# EAGLE design yuniminMotorBoardAnalog (EAGLE 4.11)
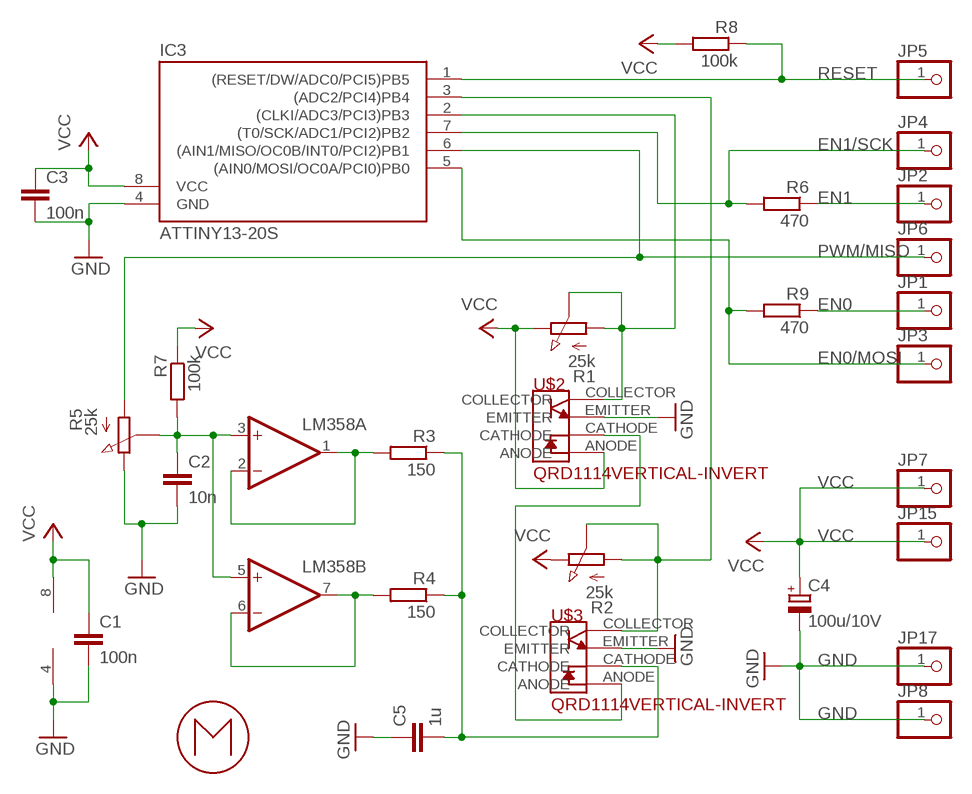
[diagram p0: schematic, sheet 1]

## Parts
C1  100n  C-EUC1206  [C1206]
C2  10n  C-EUC1206  [C1206]
C3  100n  C-EUC1206  [C1206]
C4  100u/10V  CPOL-EUC/6032-28R  [C/6032-28R]
C5  1u  C-EUC1206  [C1206]
IC3  ATTINY13-20S  [SOIC8]
JP1  PINHD-1X1  [1X01]
JP2  PINHD-1X1  [1X01]
JP3  PINHD-1X1  [1X01]
JP4  PINHD-1X1  [1X01]
JP5  PINHD-1X1  [1X01]
JP6  PINHD-1X1  [1X01]
JP7  PINHD-1X1  [1X01]
JP8  PINHD-1X1  [1X01]
JP15  PINHD-1X1  [1X01]
JP17  PINHD-1X1  [1X01]
LM358  TL062D  [SO08]
R1  25k  PC25  [PC25]
R2  25k  PC25  [PC25]
R3  150  R-EU_R1206  [R1206]
R4  150  R-EU_R1206  [R1206]
R5  25k  PC25  [PC25]
R6  470  R-EU_R1206  [R1206]
R7  100k  R-EU_R1206  [R1206]
R8  100k  R-EU_R1206  [R1206]
R9  470  R-EU_R1206  [R1206]
U$1  MOTORGW8FRONT  [GW8L_FRONT]
U$2  QRD1114VERTICAL-INVERT  [QRD1114V-INVERT]
U$3  QRD1114VERTICAL-INVERT  [QRD1114V-INVERT]

## Nets
EN0: JP1.1 R9.1
EN0/MOSI: IC3.5((AIN0/MOSI/OC0A/PCI0)PB0) JP3.1 R9.2
EN1: JP2.1 R6.1
EN1/SCK: IC3.7((T0/SCK/ADC1/PCI2)PB2) JP4.1 R6.2
GND: C1.2 C2.2 C3.2 C4.- C5.1 IC3.4(GND) JP8.1 JP17.1 LM358.4(P:V-) R5.E U$2.EMITTER U$3.EMITTER
N$1: LM358.1(A:OUT) LM358.2(A:-IN) R3.2
N$2: IC3.2((CLKI/ADC3/PCI3)PB3) R1.A R1.S U$2.COLLECTOR
N$3: LM358.6(B:-IN) LM358.7(B:OUT) R4.2
N$4: U$2.CATHODE U$3.ANODE
N$6: IC3.3((ADC2/PCI4)PB4) R2.A R2.S U$3.COLLECTOR
N$8: C2.1 LM358.3(A:+IN) LM358.5(B:+IN) R5.S R7.2
N$9: C5.2 R3.1 R4.1 U$3.CATHODE
PWM/MISO: IC3.6((AIN1/MISO/OC0B/INT0/PCI2)PB1) JP6.1 R5.A
RESET: IC3.1((RESET/DW/ADC0/PCI5)PB5) JP5.1 R8.1
VCC: C1.1 C3.1 C4.+ IC3.8(VCC) JP7.1 JP15.1 LM358.8(P:V+) R1.E R2.E R7.1 R8.2 U$2.ANODE

## Library data of the parts
C1-C3 C5 = rcl:C-EU: CAPACITOR, European symbol
C4 = rcl:CPOL-EU: POLARIZED CAPACITOR, European symbol
IC3 = avr:ATTINY13: MICROCONTROLLER 1 Kbytes FLASH 64 bytes EEPROM 64 bytes RAM 4-channel 10 bit ADC
JP1-JP8 JP15 JP17 = pinhead:PINHD-1X1: PIN HEADER
LM358 = linear:TL062: OP AMP
R1 R2 R5 = potSmdMax:PC25: VITROHM POTENTIOMETER
R3 R4 R6-R9 = rcl:R-EU_: RESISTOR, European symbol
U$1 = motors:MOTORGW8
U$2 U$3 = sensor:QRD1114

## Board
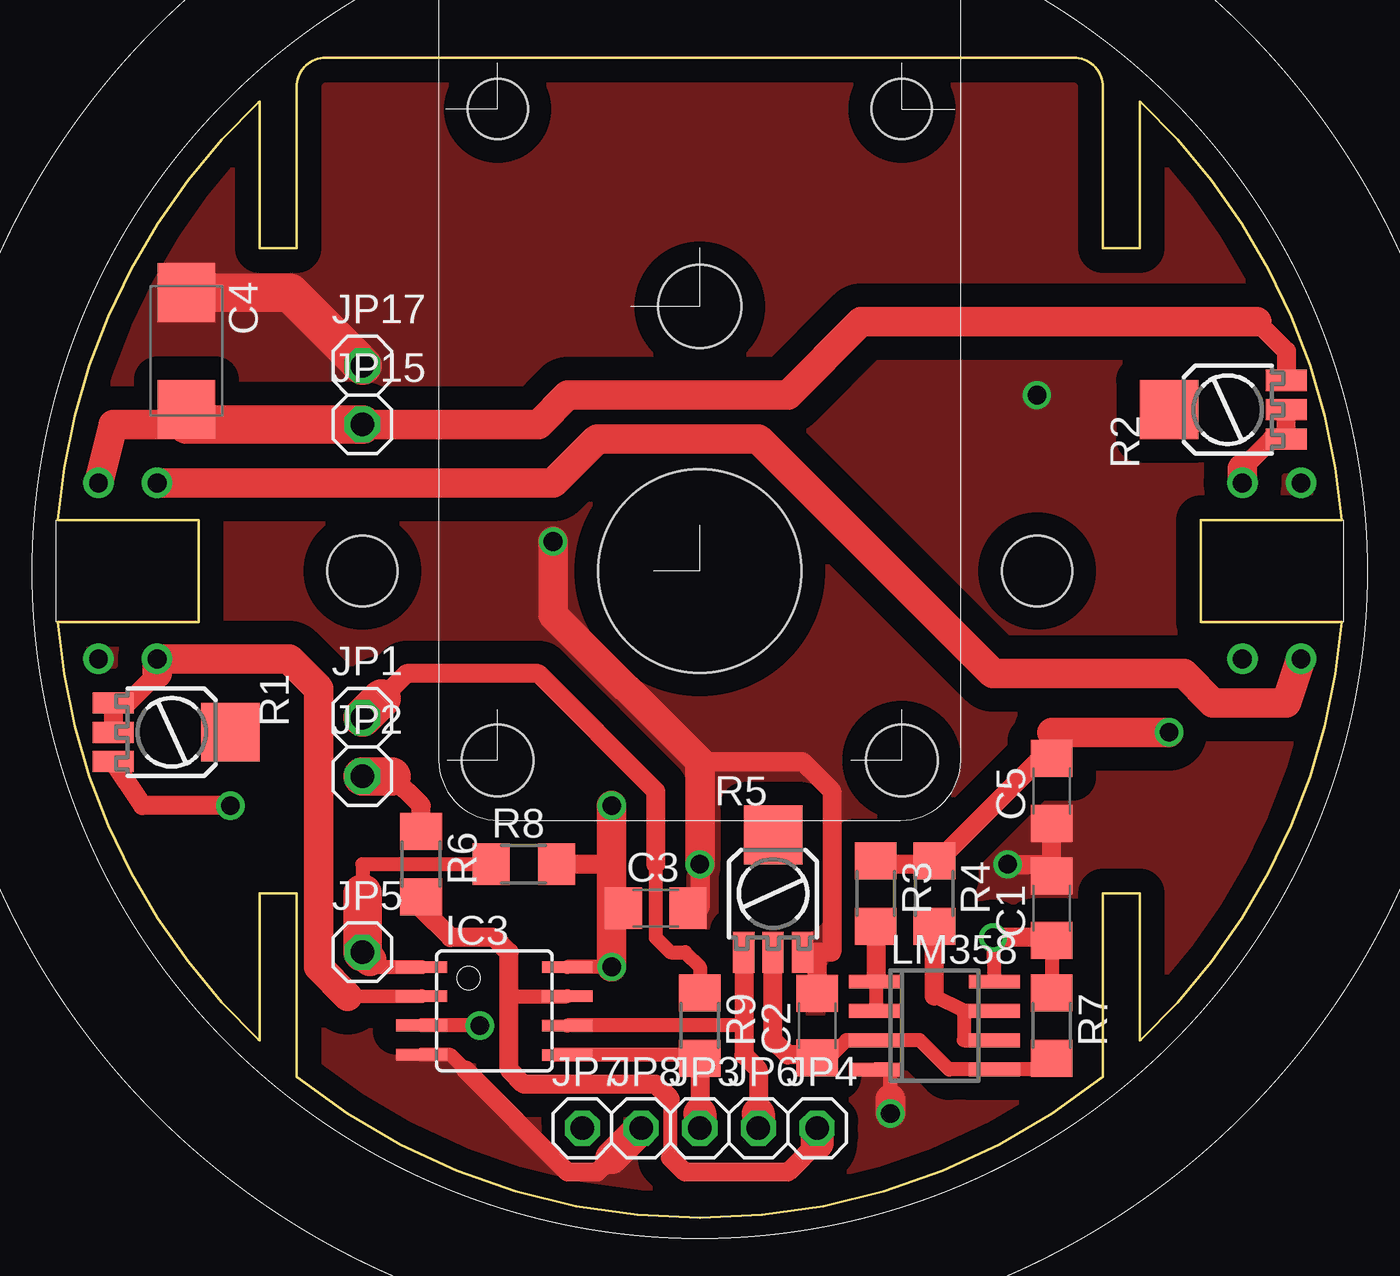
[diagram p1: board, top side]
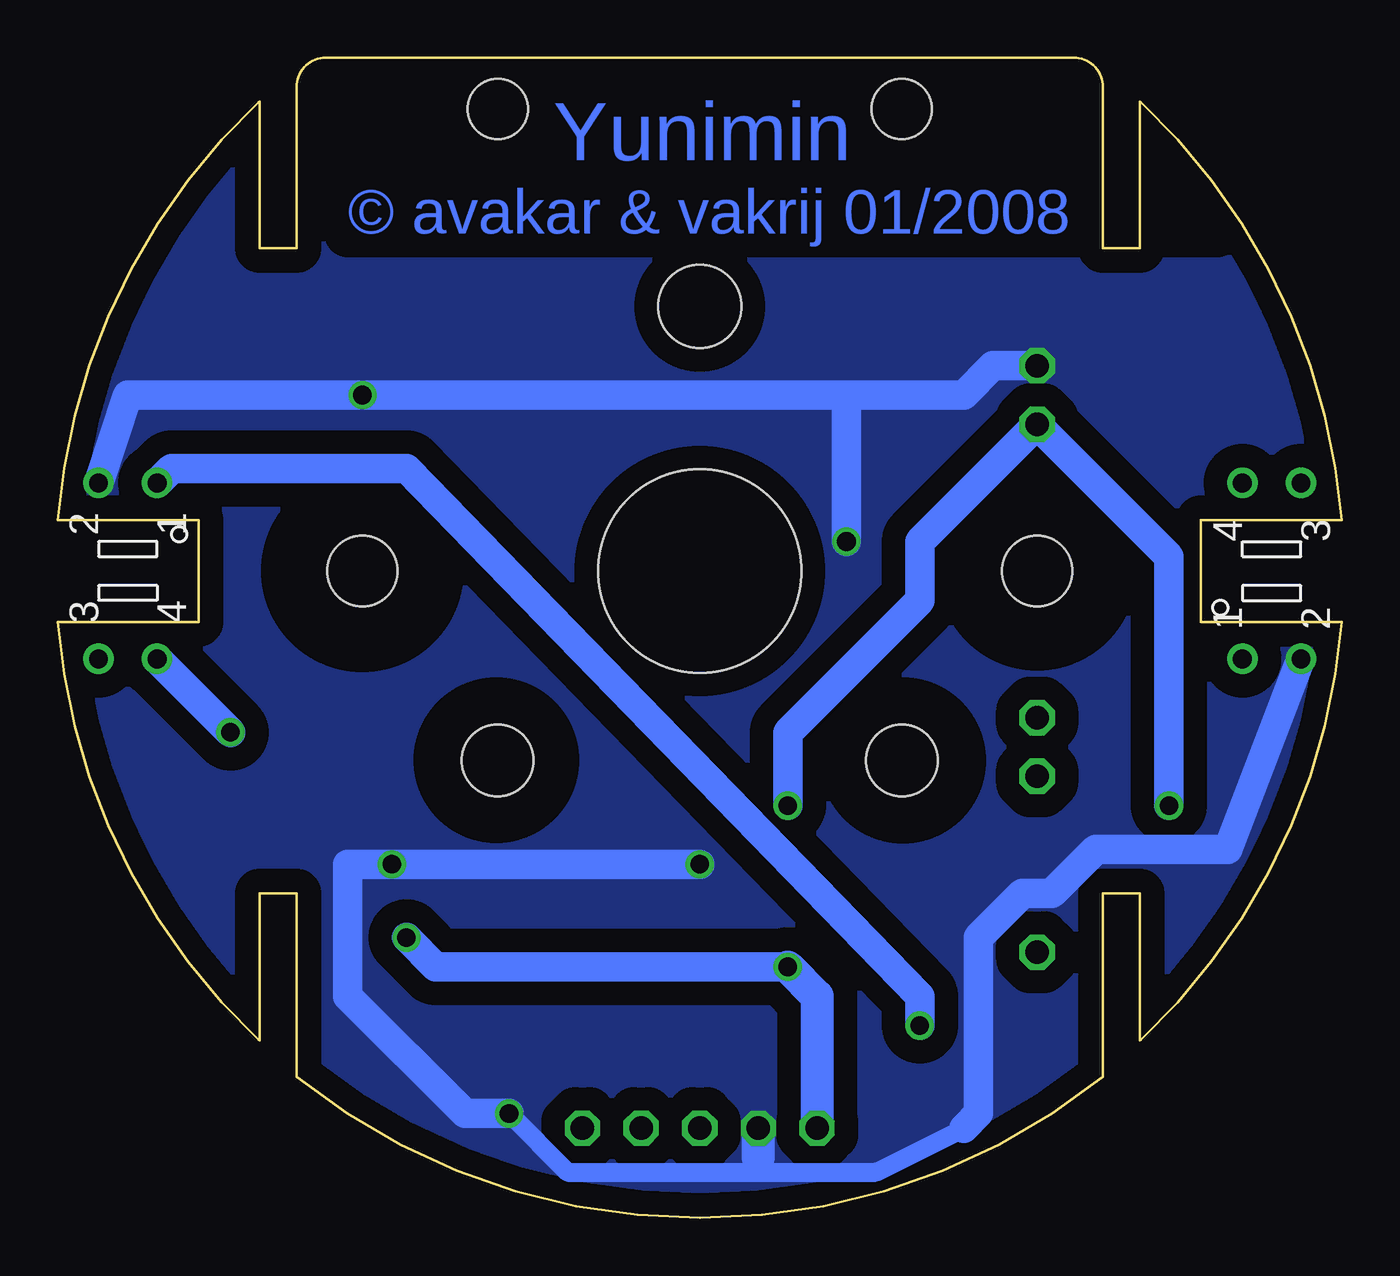
[diagram p2: board, bottom side, seen from below]

Size 55.6 x 50.24 mm. Coordinates in mm from the lower left corner, seen from the top.
Outline: 8.75,48.34 8.75,41.99 10.34,41.99 10.34,48.97 arc-90 11.61,50.24 43.99,50.24 arc-90 45.26,48.97 45.26,41.99 46.85,41.99 46.85,48.34
Outline: 8.75,7.7 8.75,14.05 10.34,14.05 10.34,6.11 arc77 45.26,6.11 45.26,14.05 46.85,14.05 46.85,7.7
Outline: 8.7,48.32 arc42 0,30.22 6.1,30.22 6.1,25.82 0,25.82 arc42 8.7,7.72
Outline: 46.9,7.72 arc42 55.6,25.82 49.5,25.82 49.5,30.22 55.6,30.22 arc42 46.9,48.32
Copper layers (1*16): Top 0.035mm / dielectric 1.5mm / Bottom 0.035mm
Design rules "default": minimum track width 10mil, minimum drill 24mil, track to track 8mil, track to pad 8mil, pad to pad 8mil, via to via 8mil, smd to smd 8mil, copper to edge 8mil, drill to drill 8mil, minimum pad ring 10mil, minimum via ring 8mil, stop-mask expansion 4mil, vias tented up to drill 0mil, thermal gap 10mil
Holes 3.05 mm at 13.2,28.02 42.41,28.02
bRestrict: area 10,24.8 to 16.4,31.2; area 39.2,24.8 to 45.6,31.3

### Footprints (pad centres in the part's own frame; a part is rotated, then mirrored left to right if it is on the bottom)
C1206 = smd 1.6 x 1.8: 1 -1.4,0; 2 1.4,0
C/6032-28R = smd 2.55 x 2.5: + 2.525,0; - -2.525,0
SOIC8 = smd 0.5 x 2.2: 1 -1.905,-3.154; 2 -0.645,-3.154; 3 0.625,-3.154; 4 1.895,-3.154; 5 1.905,3.154; 6 0.635,3.154; 7 -0.635,3.154; 8 -1.905,3.154
1X01 = drill 1.016 octagon: 1 0,0
SO08 = smd 0.6 x 2.2: 1 -1.905,-2.6; 2 -0.635,-2.6; 3 0.635,-2.6; 4 1.905,-2.6; 5 1.905,2.6; 6 0.635,2.6; 7 -0.635,2.6; 8 -1.905,2.6
PC25 = smd 0.914 x 1.778: A -1.27,-2.54; E 1.27,-2.54; S 0,-2.54 | smd 2.54 x 2.54: P$4 0,2.54
R1206 = smd 1.6 x 1.803: 1 -1.422,0; 2 1.422,0
GW8L_FRONT = hole 2.6: 20,8.75; 20,-8.75 | hole 3.1: -8.2,8.75; -8.2,-8.75 | hole 3.6: 11.45,0 | hole 8.8: 0,0
QRD1114V-INVERT = drill 0.813 round: ANODE -3.81,-1.27; CATHODE -3.81,1.27; COLLECTOR 3.81,1.27; EMITTER 3.81,-1.27

### Placement (x,y rotation side)
C1  43.04,13.41 90 top
C2  32.88,8.33 90 top
C3  25.89,13.41 0 top
C4  5.57,37.54 270 top
C5  43.04,18.49 90 top
IC3  18.91,8.97 270 top
JP1  13.2,21.67 0 top
JP2  13.2,19.13 0 top
JP3  27.8,3.89 0 top
JP4  32.88,3.89 0 top
JP5  13.2,11.51 0 top
JP6  30.34,3.89 0 top
JP7  22.72,3.89 0 top
JP8  25.26,3.89 0 top
JP15  13.2,34.37 0 top
JP17  13.2,36.91 0 top
LM358  37.96,8.33 270 top
R1  4.94,21.03 270 top
R2  50.66,35 90 top
R3  35.42,14.05 270 top
R4  37.96,14.05 270 top
R5  30.98,14.05 0 top
R6  15.74,15.32 270 top
R7  43.04,8.33 270 top
R8  20.18,15.32 0 top
R9  27.8,8.33 270 top
U$1  27.8,28.02 90 top
U$2  3.04,28.02 270 top
U$3  52.56,28.02 90 top

### Tracks (layer width: path | path; a pad name or v marks a point on that pad's centre or on a via)
EN0
  Top 0.61: 25.89,15.32 25.89,12.14 26.53,11.51 27.16,11.51 27.8,10.87 R9.1
  Top 0.813: 25.89,15.32 25.89,18.49 20.82,23.57 15.1,23.57 14.02,22.49
  Top 1.676: 14.02,22.49 JP1.1
EN0/MOSI
  Top 0.61: 21.45,7.06 IC3.5 27.65,7.06 R9.2
  Top 0.813: R9.2 27.8,4.52
  Top 1.422: 27.8,4.52 JP3.1
EN1
  Top 0.813: 14.46,19.13 15.74,17.86 R6.1
  Top 1.676: 14.46,19.13 JP2.1
EN1/SCK
  Top 0.61: 26.53,2.62 26.53,5.16 | 19.55,9.6 IC3.7
  Top 0.813: 32.88,3.25 31.61,1.98 27.16,1.98 26.53,2.62 | 26.53,5.16 25.89,5.79 20.18,5.79 19.55,6.43 19.55,9.6 19.55,11.51 18.91,12.14 17.01,12.14 15.74,13.41 R6.2
  Top 1.422: JP4.1 32.88,3.25
GND  (via drill 0.81)
  Top 0.61: LM358.4 36.05,6.43 36.05,5.16 | 17.66,6.4 17.01,7.06 IC3.4 | 32.88,10.24 33.01,10.37 C2.2
  Top 0.813: C3.2 27.16,13.28 27.8,13.41 v27.8,15.32 | v41.14,15.32 43.04,15.32 C1.2 C5.1 | 23.99,2.62 23.36,1.98 22.09,1.98 17.66,6.4 | 32.88,11.51 32.88,10.24 | 32.88,11.51 R5.E | 32.88,11.51 33.52,11.51 33.52,18.49 32.25,19.76 27.8,19.76
  Top 1.27: v36.05,4.52 36.05,5.16 | v27.8,15.32 27.8,19.76 21.45,26.11 v21.45,29.29
  Top 1.422: JP8.1 23.99,2.62
  Top 1.676: C4.- 10.04,40.07 JP17.1
  Bottom 0.813: v36.05,4.52 33.52,1.98 25.26,1.98 | 25.26,1.98 25.26,2.62 | 25.26,1.98 20.18,1.98 16.37,3.89
  Bottom 1.27: U$3.EMITTER 52.56,35.64 v42.41,35.64 21.45,35.64 | 21.45,35.64 16.37,35.64 15.1,36.91 JP17.1 | v27.8,15.32 v41.14,15.32 43.04,15.32 43.04,9.6 37.96,4.52 v36.05,4.52 | U$2.EMITTER 4.94,15.95 10.66,15.95 12.56,14.05 13.83,14.05 15.74,12.14 15.74,4.52 16.37,3.89 | v21.45,29.29 21.45,35.64
  Bottom 1.422: 25.26,2.62 JP8.1
  pour Top (isolate 1.016, no thermals): -1.41,57.23 -1.41,-1.19 55.74,-1.19 55.74,57.23
  pour Bottom (isolate 1.016, no thermals): -1.41,57.23 55.74,57.23 55.74,-1.19 -1.41,-1.19
N$1
  Top 0.61: LM358.2 35.42,8.97 35.42,10.24 LM358.1
  Top 0.813: R3.2 35.42,10.24
N$2
  Top 0.61: 12.56,9.6 IC3.2
  Top 0.813: R1.S R1.A 3.04,22.3 4.3,23.57
  Top 1.27: 12.56,9.6 11.29,10.87 11.29,22.94 10.02,24.21 U$2.COLLECTOR 4.3,23.57
N$3
  Top 0.61: LM358.7 39.23,8.97 | LM358.6 39.23,7.7 39.23,8.97 | 39.23,8.97 37.96,9.6
  Top 0.813: 37.96,9.6 R4.2
N$4
  Top 1.27: U$2.CATHODE 21.45,31.83 23.36,33.73 30.34,33.73 40.5,23.57 48.75,23.57 50.03,22.3 53.2,22.3 U$3.ANODE
N$6  (via drill 0.81)
  Top 0.61: v18.27,8.33 IC3.3
  Top 0.813: R2.S R2.A 52.56,33.73 51.3,32.46
  Top 1.27: U$3.COLLECTOR 51.3,32.46
  Bottom 1.27: v18.27,8.33 18.27,9.6 40.5,32.46 50.66,32.46 U$3.COLLECTOR
N$8
  Top 0.61: R7.2 43.04,6.43 LM358.5 38.59,6.43 37.33,7.7 LM358.3 34.15,7.7 33.52,7.06 32.88,7.06 C2.1
  Top 0.813: R5.S 30.98,7.7 31.61,7.06 32.88,7.06
N$9  (via drill 0.81)
  Top 0.61: 35.57,15.32 R3.1 | R4.1 37.17,15.32
  Top 0.813: 37.17,15.32 37.96,15.32 | 37.96,15.32 35.57,15.32 | 37.96,15.32 43.04,20.4 | R4.1 37.96,15.32 | 43.04,20.4 43.04,21.03 | 43.04,20.4 C5.2
  Top 1.27: 43.04,21.03 v48.12,21.03
  Bottom 1.27: v48.12,21.03 U$3.CATHODE
PWM/MISO
  Top 0.61: 29.71,8.33 IC3.6 | 30.34,5.16 30.34,4.52
  Top 0.813: R5.A 29.71,8.33 29.71,7.06 30.34,6.43 30.34,5.16
  Top 1.422: 30.34,4.52 JP6.1
RESET
  Top 0.61: IC3.1 13.83,10.87 13.51,11.19 | R8.1 13.2,15.32 13.2,14.05
  Top 1.422: JP5.1 13.51,11.19
  Top 1.676: 13.2,14.05 JP5.1
VCC  (via drill 0.81)
  Top 0.61: v23.99,10.87 IC3.8 | R7.1 C1.1 43.04,12.14 | v40.5,12.14 LM358.8
  Top 0.813: R1.E 3.67,17.86 v7.48,17.86 | R2.E 53.2,37.54 51.93,38.81 | 43.04,12.14 v40.5,12.14 | 23.99,15.32 R8.2 | 23.99,13.41 C3.1
  Top 1.27: U$2.ANODE 2.4,34.37 5.57,34.37 C4.+ | 51.93,38.81 34.79,38.81 31.61,35.64 22.09,35.64 20.82,34.37 JP15.1 | v23.99,17.86 23.99,15.32 23.99,13.41 v23.99,10.87
  Top 1.676: JP15.1 5.57,34.37
  Bottom 1.27: v7.48,17.86 7.48,28.65 JP15.1 18.27,29.29 18.27,26.75 23.99,21.03 v23.99,17.86 | v40.5,12.14 39.23,10.87 v23.99,10.87
  Bottom 1.422: v23.99,10.87 22.72,9.6 JP7.1

### Text on the board
Bottom: Yunimin | © avakar & vakrij 01/2008